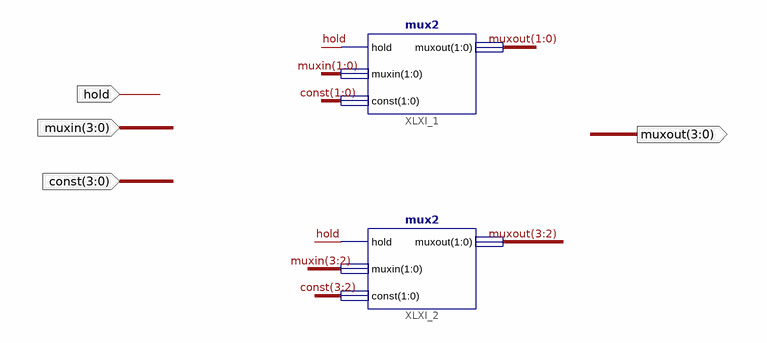
[diagram p0: schematic sheet 1]
// Xilinx ISE schematic mux4.sch (artix7) as structural Verilog: 2 symbols, 4 ports
module mux4 (
  input  hold,
  input  [3:0] muxin,
  input  [3:0] \const ,
  output [3:0] muxout
);

  mux2 XLXI_1 (.hold(hold), .muxin(muxin[1:0]), .\const (\const [1:0]), .muxout(muxout[1:0]));
  mux2 XLXI_2 (.hold(hold), .muxin(muxin[3:2]), .\const (\const [3:2]), .muxout(muxout[3:2]));
endmodule
